# Altium schematic sheet Voltage Source.SchDoc: Voltage Source
size A4; ApprovedBy: Nhatkhongbuon; Author: Nhatkhongbuon; Revision: 1.0; SheetNumber: 1; SheetTotal: 3; ProjectTitle: Mobile Robot
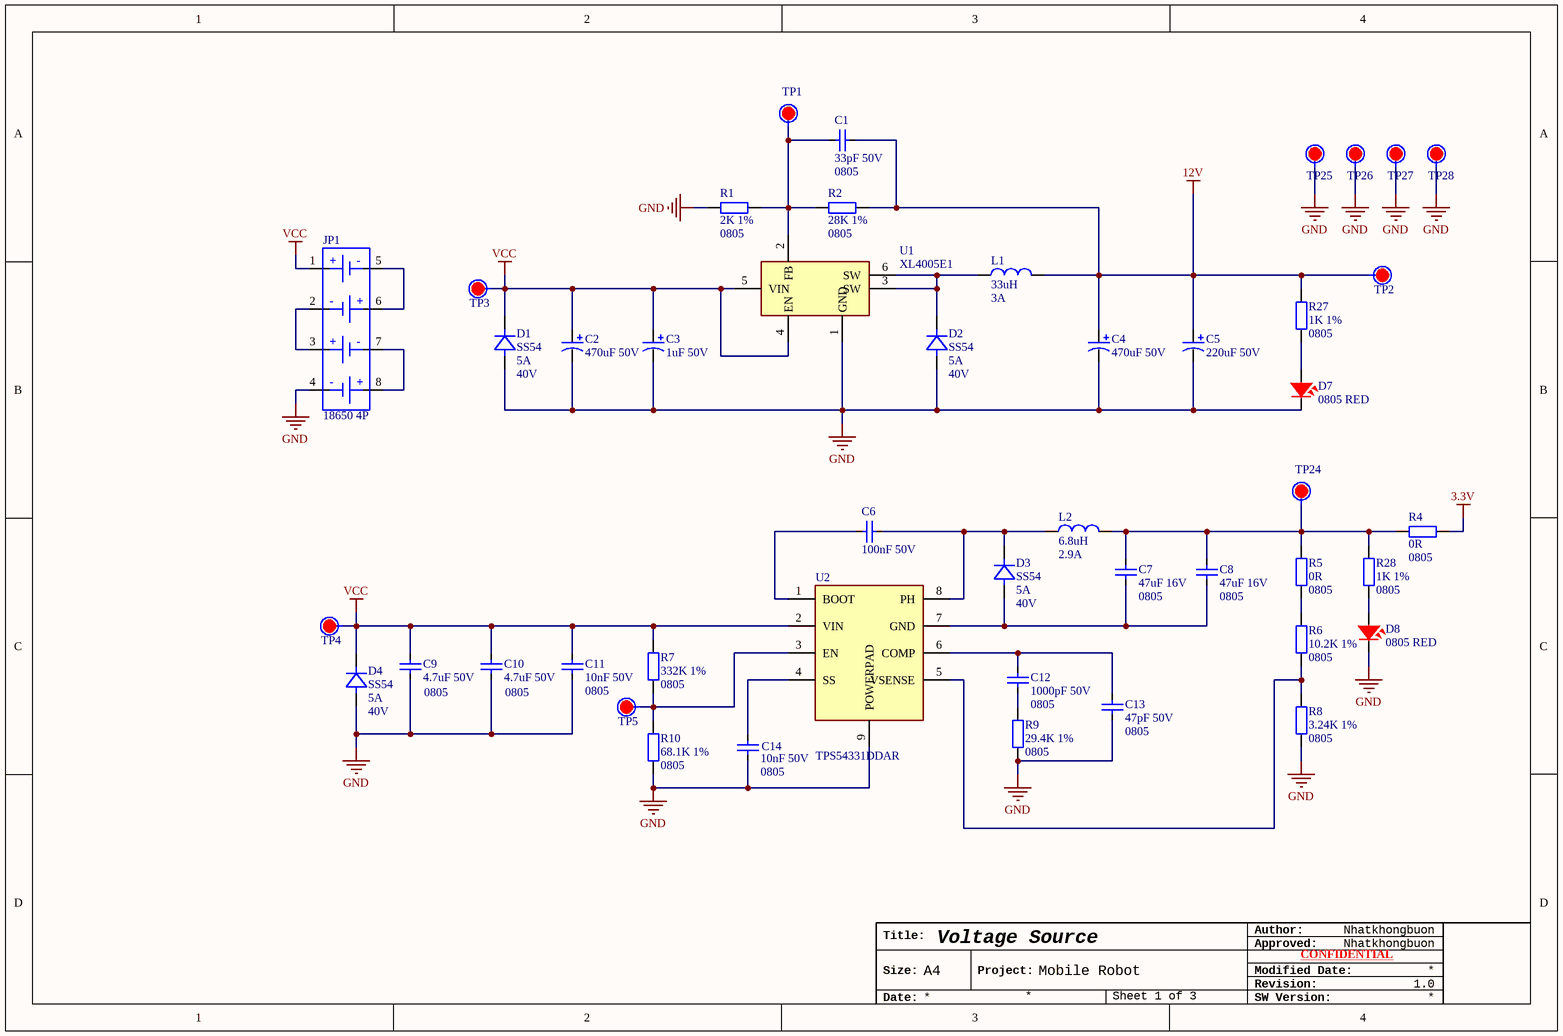
[diagram p0: Voltage Source.SchDoc]

## Parts
C1  33pF 50V  Size: 0805  [CAP_SMD_0805_NEW]
C2  470uF 50V  [CAP-ALU-SMD-D12.5xL13.5]
C3  1uF 50V  [CAP-ALU-SMD-B -NEW]
C4  470uF 50V  [CAP-ALU-SMD-D12.5xL13.5]
C5  220uF 50V  [CAP-ALU-SMD-G-NEW]
C6  100nF 50V  [CAP_SMD_0805_NEW]
C7  47uF 16V  Size: 0805  [CAP_SMD_0805_NEW]
C8  47uF 16V  Size: 0805  [CAP_SMD_0805_NEW]
C9  4.7uF 50V  Size: 0805  [CAP_SMD_0805_NEW]
C10  4.7uF 50V  Size: 0805  [CAP_SMD_0805_NEW]
C11  10nF 50V  Size: 0805  [CAP_SMD_0805_NEW]
C12  1000pF 50V  Size: 0805  [CAP_SMD_0805_NEW]
C13  47pF 50V  Size: 0805  [CAP_SMD_0805_NEW]
C14  10nF 50V  Size: 0805  [CAP_SMD_0805_NEW]
D1  SS54  Current: 5A  DC Voltage: 40V  [SMA]
D2  SS54  Current: 5A  DC Voltage: 40V  [SMA]
D3  SS54  Current: 5A  DC Voltage: 40V  [SMA]
D4  SS54  Current: 5A  DC Voltage: 40V  [SMA]
D7  0805 RED  [LED-0805-Red]
D8  0805 RED  [LED-0805-Red]
JP1  18650 4P  [18650 Holder 4P]
L1  Inductor: 33uH  Current: 3A  [L_TOR_13x7]  (hidden comment: 33uH 3A)
L2  Inductor: 6.8uH  Current: 2.9A  [CD74R]  (hidden comment: CD74R_6.8uH)
R1  2K 1%  Size: 0805  [RES_SMD_0805]
R2  28K 1%  Size: 0805  [RES_SMD_0805]
R4  0R  Size: 0805  [RES_SMD_0805]
R5  0R  Size: 0805  [RES_SMD_0805]
R6  10.2K 1%  Size: 0805  [RES_SMD_0805]
R7  332K 1%  Size: 0805  [RES_SMD_0805]
R8  3.24K 1%  Size: 0805  [RES_SMD_0805]
R9  29.4K 1%  Size: 0805  [RES_SMD_0805]
R10  68.1K 1%  Size: 0805  [RES_SMD_0805]
R27  1K 1%  Size: 0805  [RES_SMD_0805]
R28  1K 1%  Size: 0805  [RES_SMD_0805]
TP1  Test Point  [TEST_POINT]  (value not drawn)
TP2  Test Point  [TEST_POINT]  (value not drawn)
TP3  Test Point  [TEST_POINT]  (value not drawn)
TP4  Test Point  [TEST_POINT]  (value not drawn)
TP5  Test Point  [TEST_POINT]  (value not drawn)
TP24  Test Point  [TEST_POINT]  (value not drawn)
TP25  Test Point  [TEST_POINT]  (value not drawn)
TP26  Test Point  [TEST_POINT]  (value not drawn)
TP27  Test Point  [TEST_POINT]  (value not drawn)
TP28  Test Point  [TEST_POINT]  (value not drawn)
U1  XL4005E1  [TO263-5]
U2  TPS54331DDAR  [TPS54531DDAR]

## Nets
3.3V: R4.1
12V: C1.2 C4.1 C5.1 L1.2 R2.2 R27.1 TP2.1
GND: C2.2 C3.2 C4.2 C5.2 C9.1 C10.1 C11.1 C13.1 C14.1 D1.A D2.A D4.A D7.2 D8.2 JP1.4 R1.1 R8.1 R9.1 R10.1 TP25.1 TP26.1 TP27.1 TP28.1 U1.1(GND) U2.9(POWERPAD)
VCC: C2.1 C3.1 C9.2 C10.2 C11.2 D1.C D4.C JP1.1 R7.2 TP3.1 TP4.1 U1.4(EN) U1.5(VIN) U2.2(VIN)
NetC1_1: C1.1 R1.2 R2.1 TP1.1 U1.2(FB)
NetC6_1: C6.1 U2.1(BOOT)
NetC6_2: C6.2 D3.C L2.1 U2.8(PH)
NetC7_1: C7.1 C8.1 D3.A U2.7(GND)
NetC7_2: C7.2 C8.2 L2.2 R4.2 R5.2 R28.1 TP24.1
NetC12_1: C12.1 R9.2
NetC12_2: C12.2 C13.2 U2.6(COMP)
NetC14_2: C14.2 U2.4(SS)
NetD2_C: D2.C L1.1 U1.3(SW) U1.6(SW)
NetD7_1: D7.1 R27.2
NetD8_1: D8.1 R28.2
NetJP1_2: JP1.2 JP1.3
NetJP1_5: JP1.5 JP1.6
NetJP1_7: JP1.7 JP1.8
NetR5_1: R5.1 R6.2
NetR6_1: R6.1 R8.2 U2.5(VSENSE)
NetR7_1: R7.1 R10.2 TP5.1 U2.3(EN)

## Notes on the sheet
- Author:
- Title:
- Size:
- A4
- Project:
- Approved:
- Revision:
- Modified Date:
- CONFIDENTIAL
- Date:
- SW Version:
- (in symbol 18650_HLD_4P) +; -
- (in symbol XL4005E1) /

## Library data of the parts
C1 = C0805_MLCC_33pF_50V: 33 pF ±10% 50V Ceramic Capacitor C0G, NP0 0805 (2012 Metric); Manufacturer: KEMET; Manufacture Part Number: C0805C330K5GAC7800; Packaging: Cut Tape (CT); Link: https://www.digikey.com/en/products/detail/kemet/C0805C330K5GAC7800/2212525; Price: $0.10
C2 C4 = C_ALU_470uF_50V: 470uF 50V ±20% SMD,D12.5xL13.5mm Aluminum Electrolytic Capacitors - SMD ROHS; Manufacturer: Changzhou Huawei Elec; Manufacture Part Number: VT1H471MI135000CE0; Link: https://www.lcsc.com/product-detail/Aluminum-Electrolytic-Capacitors-SMD_Changzhou-Huawei-Elec-VT1H471MI135000CE0_C191227.html; Price: $ 0.36
C3 = C_ALU_1uF_50V_B: 1uF 50V 7mA@120Hz ±20% SMD,D4xL5.4mm Aluminum Electrolytic Capacitors - SMD ROHS; Manufacturer: KNSCHA; Manufacture Part Number: RST1UF50V017; Packaging: Cut Tape; Link: https://www.lcsc.com/product-detail/Aluminum-Electrolytic-Capacitors-SMD_KNSCHA-RST1UF50V017_C4747972.html; Price: $ 0.0209
C5 = C_ALU_220uF_50V_G: 220uF 50V 220mA@120Hz ±20% SMD,D10xL10.5mm Aluminum Electrolytic Capacitors - SMD ROHS; Manufacturer: KNSCHA; Manufacture Part Number: XT220UF50V90RV0078; Packaging: Cut Tape (CT); Link: https://www.lcsc.com/product-detail/Aluminum-Electrolytic-Capacitors-SMD_KNSCHA-XT220UF50V90RV0078_C2992609.html; Price: $ 0.1071
C6 = C0805_MLCC_100nF_50V: 0.1 µF ±10% 50V Ceramic Capacitor X7R 0805 (2012 Metric); Manufacturer: YAGEO; Manufacture Part Number: CC0805KRX7R9BB104; Packaging: Cut Tape (CT); Link: https://www.digikey.cn/en/products/detail/yageo/CC0805KRX7R9BB104/302874; Price: $0.10; Size: 0805
C7 C8 = C0805_MLCC_47uF_16V: 47 µF ±10% 16V Ceramic Capacitor X5R 1210 (3225 Metric); Manufacturer: Samsung Electro-Mechanics; Manufacture Part Number: CL32A476KOJNNNE; Packaging: Cut Tape (CT); Link: https://www.digikey.cn/en/products/detail/samsung-electro-mechanics/CL32A476KOJNNNE/3889034; Price: $0.51
C9 C10 = C0805_MLCC_4.7uF_50V: 4.7 µF ±10% 50V Ceramic Capacitor X5R 0805 (2012 Metric); Manufacturer: Samsung Electro-Mechanics; Manufacture Part Number: CL21A475KBQNNNE; Packaging: Cut Tape (CT); Link: https://www.digikey.cn/en/products/detail/samsung-electro-mechanics/CL21A475KBQNNNE/3886906; Price: $0.23
C11 C14 = C0805_MLCC_10nF_50V: 10000 pF ±10% 50V Ceramic Capacitor X7R 0805 (2012 Metric); Manufacturer: Samsung Electro-Mechanics; Manufacture Part Number: CL21B103KBANNNC; Packaging: Cut Tape (CT); Link: https://www.digikey.cn/en/products/detail/samsung-electro-mechanics/CL21B103KBANNNC/3886673; Price: $0.10
C12 = C0805_MLCC_1000pF_50V: 1000 pF ±10% 50V Ceramic Capacitor X7R 0805 (2012 Metric); Manufacturer: KEMET; Manufacture Part Number: C0805C102K5RAC7800; Packaging: Cut Tape (CT); Link: https://www.digikey.cn/en/products/detail/kemet/C0805C102K5RAC7800/411146; Price: $0.11
C13 = C0805_MLCC_47pF_50V: 47 pF ±5% 50V Ceramic Capacitor C0G, NP0 0805 (2012 Metric); Manufacturer: YAGEO; Manufacture Part Number: CC0805JRNPO9BN470; Packaging: Cut Tape (CT); Link: https://www.digikey.cn/en/products/detail/yageo/CC0805JRNPO9BN470/302841; Price: $0.10
D1-D4 = SS54: DIODE SCHOTTKY 40V 5A SMA; Manufacturer: EVVO; Manufacture Part Number: SS54; Packaging: Cut Tape (CT); Link: https://www.digikey.cn/en/products/detail/evvo/SS54/21407219; Price: $0.73
D7 D8 = LED_0805_RED: Red 625nm LED Indication - Discrete 2V 0805 (2012 Metric); Manufacturer: Würth Elektronik; Manufacture Part Number: 150080RS75000; Packaging: Cut Tape (CT); Link: https://www.digikey.cn/en/products/detail/w%C3%BCrth-elektronik/150080RS75000/4489918; Price: $0.19
JP1 = 18650_HLD_4P: 18650 Holder 4P; VNese Price: 17000; Link Shopee: https://linhkienchatluong.vn/de-pin---mu-pin/de-4-pin-18650-chan-han-mach-pcb_sp541_ct11852.aspx
L1 = L_33uH_3A: Toroidal Coil Inductor 33uH 3A; VNese Price: 3200; Link Shopee: https://linhkienchatluong.vn/cuon-cam-xuyen/cuon-cam-xuyen-33uh-3a_sp469_ct146.aspx
L2 = CD74R_6.8uH: 2.9A 6.8uH ±30% SMD,7.5x7.5mm Power Inductors ROHS; Manufacturer: SHOU HAN; Manufacture Part Number: CYH74-6.8UH; Link: https://www.lcsc.com/product-detail/Power-Inductors_SHOU-HAN-CYH74-6-8UH_C19268626.html; Price: $ 0.0674
R1 = R0805_2K: 2 kOhms ±1% 0.125W, 1/8W Chip Resistor 0805 (2012 Metric) Automotive AEC-Q200 Thick Film; Manufacturer: Panasonic Electronic Components; Manufacture Part Number: ERJ-6ENF2001V; Packaging: Cut Tape (CT); Link: https://www.digikey.com/en/products/detail/panasonic-electronic-components/ERJ-6ENF2001V/111341; Price: $0.10
R2 = R0805_28K: 28 kOhms ±1% 0.125W, 1/8W Chip Resistor 0805 (2012 Metric) Moisture Resistant Thick Film; Manufacturer: YAGEO; Manufacture Part Number: RC0805FR-0728KL; Packaging: Cut Tape (CT); Link: https://www.digikey.com/en/products/detail/yageo/RC0805FR-0728KL/727788; Price: $0.10
R4 R5 = R0805_0R: 0 Ohms Jumper Chip Resistor 0805 (2012 Metric) Automotive AEC-Q200 Thick Film; Manufacturer: Vishay Dale; Manufacture Part Number: CRCW08050000Z0EA; Packaging: Cut Tape (CT); Link: https://www.digikey.cn/en/products/detail/vishay-dale/CRCW08050000Z0EA/1175125; Price: $0.10
R6 = R0805_10.2K: 10.2 kOhms ±1% 0.125W, 1/8W Chip Resistor 0805 (2012 Metric) Moisture Resistant Thick Film; Manufacturer: YAGEO; Manufacture Part Number: RC0805FR-0710K2L; Packaging: Cut Tape (CT); Link: https://www.digikey.cn/en/products/detail/yageo/RC0805FR-0710K2L/727538; Price: $0.10
R7 = R0805_332K: 332 kOhms ±1% 0.125W, 1/8W Chip Resistor 0805 (2012 Metric) Moisture Resistant Thick Film; Manufacturer: YAGEO; Manufacture Part Number: RC0805FR-07332KL; Packaging: Cut Tape (CT); Price: $0.10; Link: https://www.digikey.cn/en/products/detail/yageo/RC0805FR-07332KL/727869
R8 = R0805_3.24K: 3.24 kOhms ±1% 0.125W, 1/8W Chip Resistor 0805 (2012 Metric) Moisture Resistant Thick Film; Manufacturer: YAGEO; Manufacture Part Number: RC0805FR-073K24L; Packaging: Cut Tape (CT); Link: https://www.digikey.cn/en/products/detail/yageo/RC0805FR-073K24L/727811; Price: $0.10
R9 = R0805_29.4K: 29.4 kOhms ±1% 0.125W, 1/8W Chip Resistor 0805 (2012 Metric) Moisture Resistant Thick Film; Manufacturer: YAGEO; Manufacture Part Number: RC0805FR-0729K4L; Packaging: Cut Tape (CT); Price: $0.10; Link: https://www.digikey.cn/en/products/detail/yageo/RC0805FR-0729K4L/727796
R10 = R0805_68.1K: 68.1 kOhms ±1% 0.125W, 1/8W Chip Resistor 0805 (2012 Metric) Moisture Resistant Thick Film; Manufacturer: YAGEO; Manufacture Part Number: RC0805FR-0768K1L; Packaging: Cut Tape (CT); Price: $0.10; Link: https://www.digikey.cn/en/products/detail/yageo/RC0805FR-0768K1L/728100?s=N4IgTCBcDaIEoGEAMAOJBWAYnAtEg7AGwoDSAjADIgC6AvkA
R27 R28 = R0805_1K: 1 kOhms ±1% 0.125W, 1/8W Chip Resistor 0805 (2012 Metric) Moisture Resistant Thick Film; Manufacturer: YAGEO; Manufacture Part Number: 311-1.00KCRCT-ND; Packaging: Cut Tape (CT); Link: https://www.digikey.com/en/products/detail/yageo/RC0805FR-071KL/727444; Price: $0.10
TP1-TP5 TP24-TP28 = TEST_POINT
U1 = XL4005E1: Step-down type 800mV~30V 5A 5V~32V TO-263-5 DC-DC Converters ROHS; Manufacturer: XLSEMI; Manufacture Part Number: XL4005E1; Link: https://www.lcsc.com/product-detail/DC-DC-Converters_XLSEMI-XL4005E1_C73332.html; Price: $0.68
U2 = TPS54331DDAR: Buck Switching Regulator IC Positive Adjustable 0.8V 1 Output 3A 8-PowerSOIC (0.154", 3.90mm Width); Manufacturer: Texas Instruments; Manufacture Part Number: TPS54331DDAR; Packaging: Cut Tape; Link: https://www.digikey.cn/en/products/detail/texas-instruments/TPS54331DDAR/3053257; Price: $1.88